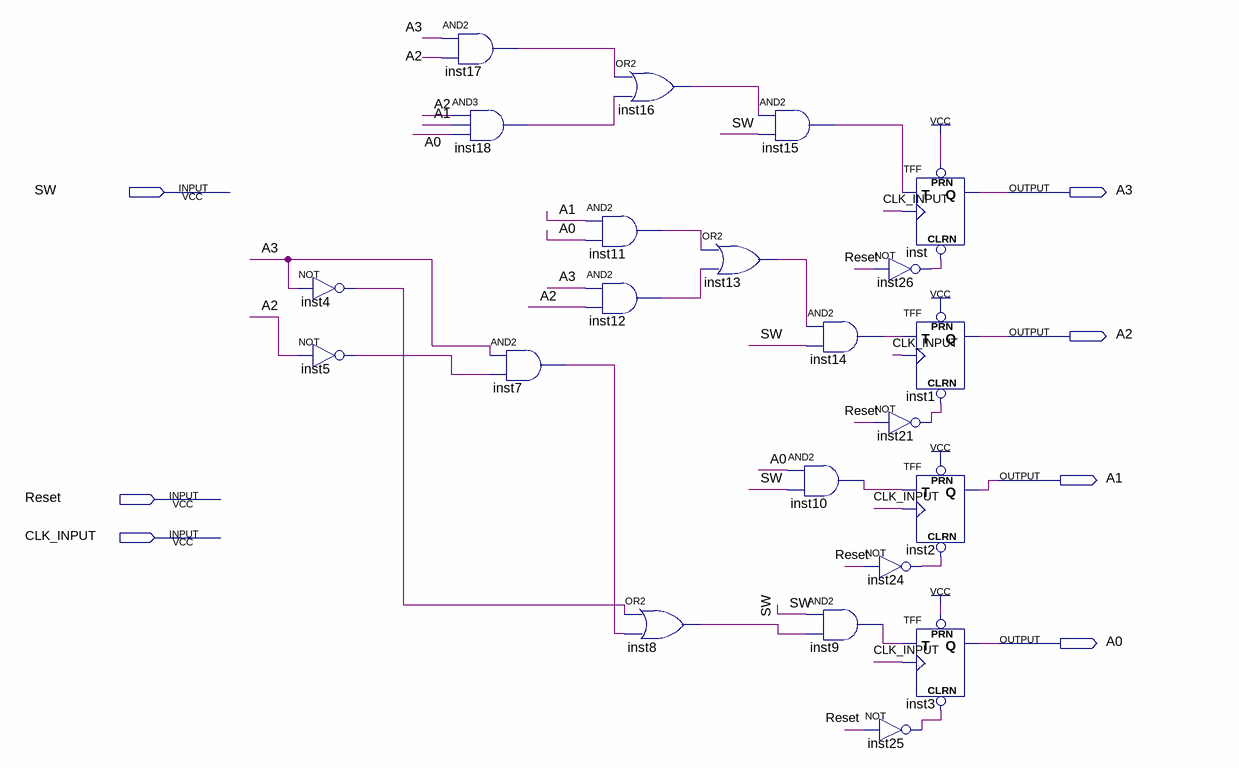
[diagram p0: schematic sheet]
// Quartus schematic SequentialCircuit.bdf as structural Verilog: 22 symbols, 7 pins
module SequentialCircuit (
  input  SW,
  input  Reset,
  input  CLK_INPUT,
  output A3,
  output A2,
  output A1,
  output A0
);

  wire inst4_out, inst5_out, inst7_out, inst8_out, inst9_out, inst10_out, inst11_out, inst12_out, inst13_out,
       inst14_out, inst15_out, inst16_out, inst17_out, inst18_out, inst21_out, inst24_out, inst25_out,
       inst26_out;

  not inst4 (inst4_out, A3);
  not inst5 (inst5_out, A2);
  and inst17 (inst17_out, A3, A2);
  and inst18 (inst18_out, A2, A1, A0);
  and inst7 (inst7_out, A3, inst5_out);
  and inst11 (inst11_out, A1, A0);
  and inst12 (inst12_out, A3, A2);
  or inst16 (inst16_out, inst17_out, inst18_out);
  or inst8 (inst8_out, inst4_out, inst7_out);
  or inst13 (inst13_out, inst11_out, inst12_out);
  and inst15 (inst15_out, inst16_out, SW);
  and inst14 (inst14_out, inst13_out, SW);
  and inst10 (inst10_out, A0, SW);
  and inst9 (inst9_out, SW, inst8_out);
  not inst26 (inst26_out, Reset);
  not inst21 (inst21_out, Reset);
  not inst24 (inst24_out, Reset);
  not inst25 (inst25_out, Reset);
  TFF inst (.PRN(1'b1), .CLRN(inst26_out), .T(inst15_out), .CLK(CLK_INPUT), .Q(A3));
  TFF inst1 (.PRN(1'b1), .CLRN(inst21_out), .T(inst14_out), .CLK(CLK_INPUT), .Q(A2));
  TFF inst2 (.PRN(1'b1), .CLRN(inst24_out), .T(inst10_out), .CLK(CLK_INPUT), .Q(A1));
  TFF inst3 (.PRN(1'b1), .CLRN(inst25_out), .T(inst9_out), .CLK(CLK_INPUT), .Q(A0));
endmodule
